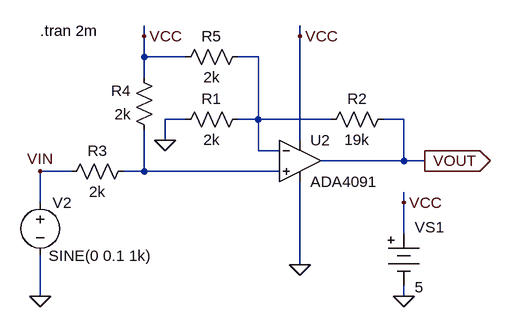
[diagram p0: schematic fig-02-01-33(a).asc]
fig-02-01-33(a).asc, the LTspice schematic file:
Version 4
SHEET 1 880 680
WIRE -32 -16 -32 -32
WIRE 208 -16 208 -32
WIRE -32 16 -32 -16
WIRE 32 16 -32 16
WIRE 144 16 112 16
WIRE -32 48 -32 16
WIRE 32 112 0 112
WIRE 144 112 144 16
WIRE 144 112 112 112
WIRE 256 112 144 112
WIRE 368 112 336 112
WIRE 0 144 0 112
WIRE 208 144 208 -16
WIRE 144 160 144 112
WIRE 176 160 144 160
WIRE 368 176 368 112
WIRE 368 176 240 176
WIRE 400 176 368 176
WIRE -144 192 -192 192
WIRE -32 192 -32 128
WIRE -32 192 -64 192
WIRE 176 192 -32 192
WIRE -192 240 -192 192
WIRE 368 240 368 224
WIRE 368 288 368 240
WIRE 208 336 208 208
WIRE -192 384 -192 320
WIRE 368 384 368 368
FLAG 208 336 0
FLAG 400 176 VOUT
IOPIN 400 176 Out
FLAG -192 384 0
FLAG 0 144 0
FLAG 368 384 0
FLAG 368 240 VCC
FLAG 208 -16 VCC
FLAG -32 -16 VCC
FLAG -192 192 VIN
SYMBOL res 128 96 R90
WINDOW 0 0 56 VBottom 2
WINDOW 3 32 56 VTop 2
SYMATTR InstName R1
SYMATTR Value 2k
SYMBOL res 352 96 R90
WINDOW 0 0 56 VBottom 2
WINDOW 3 32 56 VTop 2
SYMATTR InstName R2
SYMATTR Value 19k
SYMBOL res -48 176 R90
WINDOW 0 0 56 VBottom 2
WINDOW 3 32 56 VTop 2
SYMATTR InstName R3
SYMATTR Value 2k
SYMBOL res -16 144 R180
WINDOW 0 36 76 Left 2
WINDOW 3 36 40 Left 2
SYMATTR InstName R4
SYMATTR Value 2k
SYMBOL voltage -192 224 R0
WINDOW 0 19 16 Left 2
WINDOW 3 13 98 Left 2
WINDOW 123 0 0 Left 0
WINDOW 39 0 0 Left 0
SYMATTR InstName V2
SYMATTR Value SINE(0 0.1 1k)
SYMBOL res 128 0 R90
WINDOW 0 0 56 VBottom 2
WINDOW 3 32 56 VTop 2
SYMATTR InstName R5
SYMATTR Value 2k
SYMBOL Misc\\battery 368 272 R0
WINDOW 0 17 6 Left 2
WINDOW 3 17 98 Left 2
WINDOW 123 0 0 Left 0
WINDOW 39 0 0 Left 0
SYMATTR InstName VS1
SYMATTR Value 5
SYMBOL Opamps\\ADA4091 208 112 R0
SYMATTR InstName U2
TEXT -192 -24 Left 2 !.tran 2m

The netlist it stands for:
* fig-02-01-33(a).asc
R1 N001 0 2k
R2 VOUT N001 19k
R3 N002 VIN 2k
R4 N002 VCC 2k
V2 VIN 0 SINE(0 0.1 1k)
R5 N001 VCC 2k
VS1 VCC 0 5
XU2 N002 N001 VCC 0 VOUT ADA4091  ; pins In+ In- V+ V- OUT
.tran 2m
.lib ADI.lib
.backanno
.end